# EAGLE design pot-boardDesp (EAGLE 6.6.0)
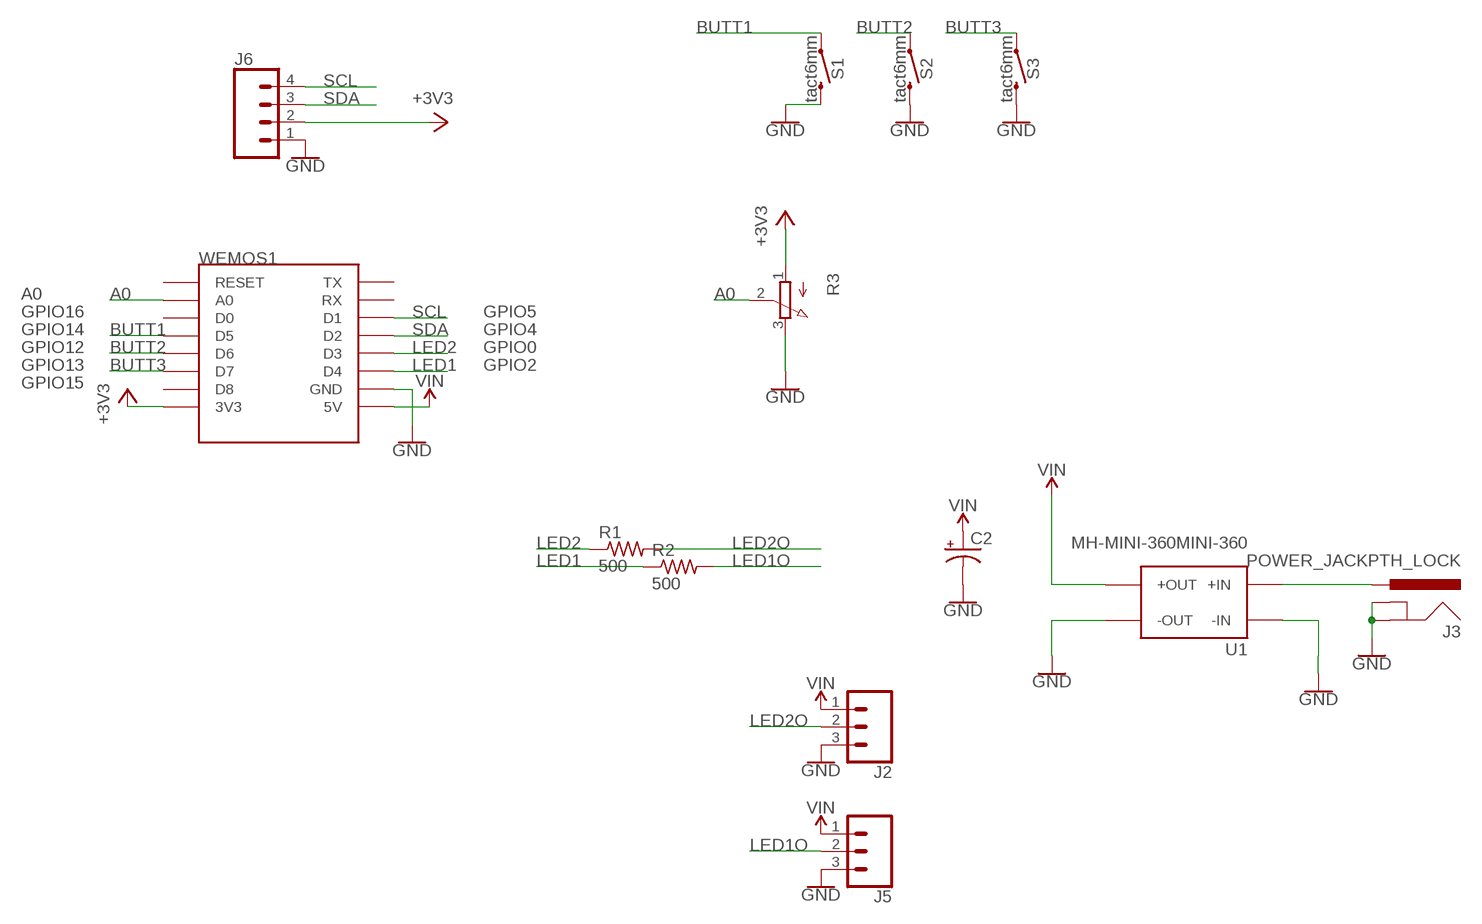
[diagram p0: schematic, sheet 1]

## Parts
C2  CPOL-USE3.5-8  [E3,5-8]
J2  CONN_03  [1X03]
J3  POWER_JACKPTH_LOCK  [POWER_JACK_PTH_LOCK]
J5  CONN_03  [1X03]
J6  CONN_04  [1X04]
R1  500  R-US_R0805  [R0805]
R2  500  R-US_R0805  [R0805]
R3  3RP/1610N  [3RP/1610N]
S1  tact6mm  MOMENTARY-SWITCH-SPST-PTH-6.0MM  [TACTILE_SWITCH_PTH_6.0MM]
S2  tact6mm  MOMENTARY-SWITCH-SPST-PTH-6.0MM  [TACTILE_SWITCH_PTH_6.0MM]
S3  tact6mm  MOMENTARY-SWITCH-SPST-PTH-6.0MM  [TACTILE_SWITCH_PTH_6.0MM]
U1  MH-MINI-360MINI-360  [MH-MINI-360]
WEMOS1  WEMOS-D1-MINI  [WEMOS-D1-MINI]

## Nets
+3V3: J6.2 R3.1(A) WEMOS1.3V3
A0: R3.2(S) WEMOS1.A0
BUTT1: S1.1 WEMOS1.D5
BUTT2: S2.1 WEMOS1.D6
BUTT3: S3.1 WEMOS1.D7
GND: C2.- J2.3 J3.GND J3.GNDBREAK J5.3 J6.1 R3.3(E) S1.3 S2.3 S3.3 U1.P$1(-IN) U1.P$4(-OUT) WEMOS1.GND
LED1: R2.1 WEMOS1.D4
LED1O: J5.2 R2.2
LED2: R1.1 WEMOS1.D3
LED2O: J2.2 R1.2
N$1: J3.PWR U1.P$2(+IN)
SCL: J6.4 WEMOS1.D1
SDA: J6.3 WEMOS1.D2
VIN: C2.+ J2.1 J5.1 U1.P$3(+OUT) WEMOS1.5V
Unconnected: WEMOS1.D0 WEMOS1.D8 WEMOS1.RESET WEMOS1.RX WEMOS1.TX

## Notes on the sheet
- A0
- GPIO16 | GPIO5
- GPIO14 | GPIO4
- GPIO12 | GPIO0
- GPIO13 | GPIO2
- GPIO15

## Library data of the parts
C2 = adafruit:CPOL-US: POLARIZED CAPACITOR, American symbol
J2 J5 = SparkFun-Connectors:CONN_03: Multi connection point. Often used as Generic Header-pin footprint for 0.1 inch spaced/style header connections On any of the 0.1 inch spaced packages, you can populate with these: Break Away Headers - Straight <https://www.sparkfun.com/products/116> (PRT-00116) Break Away Male Headers - Right Angle <https://www.sparkfun.com/products/553> (PRT-00553) Female Headers <https://www.sparkfun.com/products/115> (PRT-00115) Break Away Headers - Machine Pin <https://www.sparkfun.com/products/117> (PRT-00117) Break Away Female Headers - Swiss Machine Pin <https://www.sparkfun.com/products/743> (PRT-00743) Stackable Header - 3 Pin (Female, 0.1") <https://www.sparkfun.com/products/13875> (PRT-13875) For SCREWTERMINALS and SPRING TERMINALS visit here: Screw Terimnals on SparkFun.com <https://www.sparkfun.com/search/results?term=Screw+Terminals> (5mm/3.5mm/2.54mm spacing) This device is also useful as a general connection point to wire up your design to another part of your project. Our various solder wires solder well into these plated through hole pads. Hook-Up Wire - Assortment (Stranded, 22 AWG) <https://www.sparkfun.com/products/11375> (PRT-11375) Hook-Up Wire - Assortment (Solid Core, 22 AWG) <https://www.sparkfun.com/products/11367> (PRT-11367) View the entire wire category on our website here <https://www.sparkfun.com/categories/141> Special notes: Molex polarized connector foot print use with SKU : PRT-08232 with associated crimp pins and housings.
J3 = SparkFun-Connectors:POWER_JACK: Power Jack Connector This is the standard 5.5mm barrel jack for power. The PTH is the most common, proven, reliable, footprint. The Slot footprint only works if the mill layer is transmitted to the PCB fab house so be warned. Here are the connectors we sell at SparkFun: DC Barrel Power Jack/Connector <https://www.sparkfun.com/products/119> (PRT-00119) DC Barrel Power Jack/Connector (SMD) <https://www.sparkfun.com/products/12748> (PRT-12748) DC Barrel Jack Adapter - Breadboard Compatible <https://www.sparkfun.com/products/10811> (PRT-10811) It is used on this SparkFun product (and many, many others): SparkFun RedBoard - Programmed with Arduino <https://www.sparkfun.com/products/12757> (DEV-12757) Also, if you need a mating power supply or connector, please check these out: Wall Adapter Power Supply - 9VDC 650mA <https://www.sparkfun.com/products/298> (TOL-00298) DC Barrel Jack Adapter - Male <https://www.sparkfun.com/products/10287> (PRT-10287); PROD_ID: CONN-08197; SF_ID: PRT-00119
J6 = SparkFun-Connectors:CONN_04: Multi connection point. Often used as Generic Header-pin footprint for 0.1 inch spaced/style header connections On any of the 0.1 inch spaced packages, you can populate with these: Break Away Headers - Straight <https://www.sparkfun.com/products/116> (PRT-00116) Break Away Male Headers - Right Angle <https://www.sparkfun.com/products/553> (PRT-00553) Female Headers <https://www.sparkfun.com/products/115> (PRT-00115) Break Away Headers - Machine Pin <https://www.sparkfun.com/products/117> (PRT-00117) Break Away Female Headers - Swiss Machine Pin <https://www.sparkfun.com/products/743> (PRT-00743) For SCREWTERMINALS and SPRING TERMINALS visit here: Screw Terimnals on SparkFun.com <https://www.sparkfun.com/search/results?term=Screw+Terminals> (5mm/3.5mm/2.54mm spacing) This device is also useful as a general connection point to wire up your design to another part of your project. Our various solder wires solder well into these plated through hole pads. Hook-Up Wire - Assortment (Stranded, 22 AWG) <https://www.sparkfun.com/products/11375> (PRT-11375) Hook-Up Wire - Assortment (Solid Core, 22 AWG) <https://www.sparkfun.com/products/11367> (PRT-11367) View the entire wire category on our website here <https://www.sparkfun.com/categories/141> Special notes: Molex polarized connector foot print use with SKU : PRT-08231 with associated crimp pins and housings. 1MM SMD Version SKU: PRT-10208; PROD_ID: CONN-09696
R1 R2 = adafruit:R-US_: RESISTOR, American symbol
R3 = pot:3RP/1610N: 16mm Potentiometer one level Source: http://www.alphapotentiometers.net/html/16mm_pot_2.html
S1-S3 = SparkFun-Switches:MOMENTARY-SWITCH-SPST: Momentary Switch (Pushbutton) - SPST Normally-open (NO) SPST momentary switches (buttons, pushbuttons). Variants PTH-12MM - 12mm square, through-hole Momentary Pushbutton Switch - 12mm Square <https://www.sparkfun.com/products/9190> (COM-09190) PTH-6.0MM, PTH-6.0MM-KIT - 6.0mm square, through-hole Mini Pushbutton Switch <https://www.sparkfun.com/products/97> (COM-00097) KIT package intended for soldering kit's - only one side of pads' copper is exposed. PTH-RIGHT-ANGLE-KIT - Right-angle, through-hole Right Angle Tactile Button <https://www.sparkfun.com/products/10791> - Used on SparkFun BigTime Watch Kit <https://www.sparkfun.com/products/11734> SMD-12MM - 12mm square, surface-mount Tactile Button - SMD (12mm) <https://www.sparkfun.com/products/12993> (COM-12993) Used on SparkFun PicoBoard <https://www.sparkfun.com/products/11888> SMD-4.5MM - 4.5mm Square Trackball Switch Used on SparkFun Blackberry Trackballer Breakout <https://www.sparkfun.com/products/13169> SMD-4.6MMX2.8MM - 4.60mm x 2.80mm, surface mount Used on SparkFun SAMD21 Mini Breakout <https://www.sparkfun.com/products/13664> SMD-5.2MM, SMD-5.2-REDUNDANT - 5.2mm square, surface-mount Mini Pushbutton Switch - SMD <https://www.sparkfun.com/products/8720> (COM-08720) Used on Arduino Pro Mini <https://www.sparkfun.com/products/11114> REDUNDANT package connects both switch circuits together SMD-6.0X3.5MM - 6.0 x 3.5mm, surface mount Momentary Reset Switch SMD <https://www.sparkfun.com/products/8229> (COM-08229) SMD-6.2MM-TALL - 6.2mm square, surface mount Tactile Button - SMD (6mm) <https://www.sparkfun.com/products/12992> Used on SparkFun Digital Sandbox <https://www.sparkfun.com/products/12651> SMD-RIGHT-ANGLE - Right-angle, surface mount Used on SparkFun Block for Intel® Edison - Arduino <https://www.sparkfun.com/products/13036>; PROD_ID: SWCH-08441; SF_SKU: COM-00097
U1 = MP1584EN-1484249208697-powermodules:MH-MINI-360
WEMOS1 = esp8266modules:WEMOS-D1-MINI: WeMos.cc D1 mini ESP8266 module

## Board
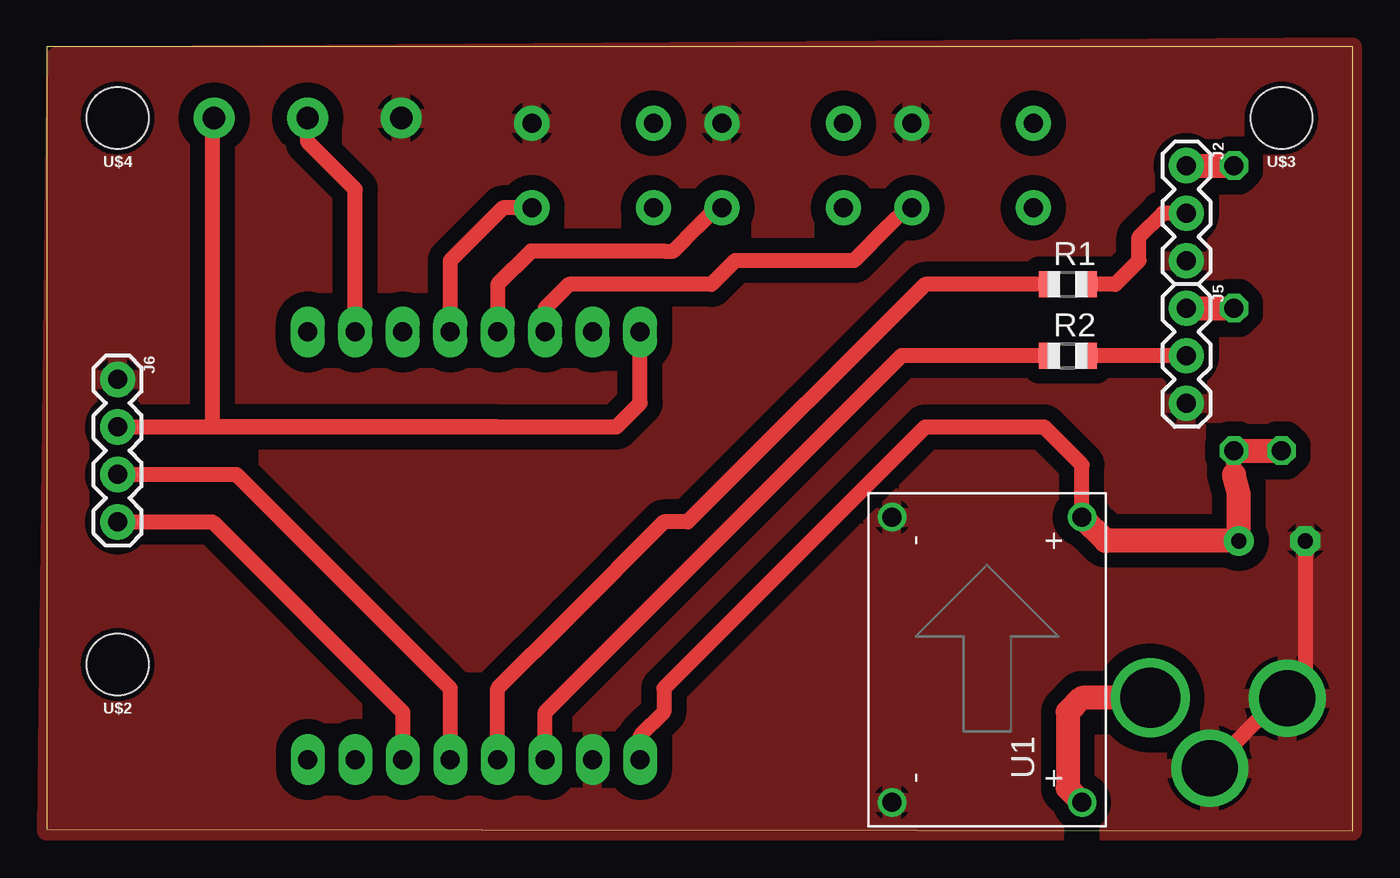
[diagram p1: board, top side]
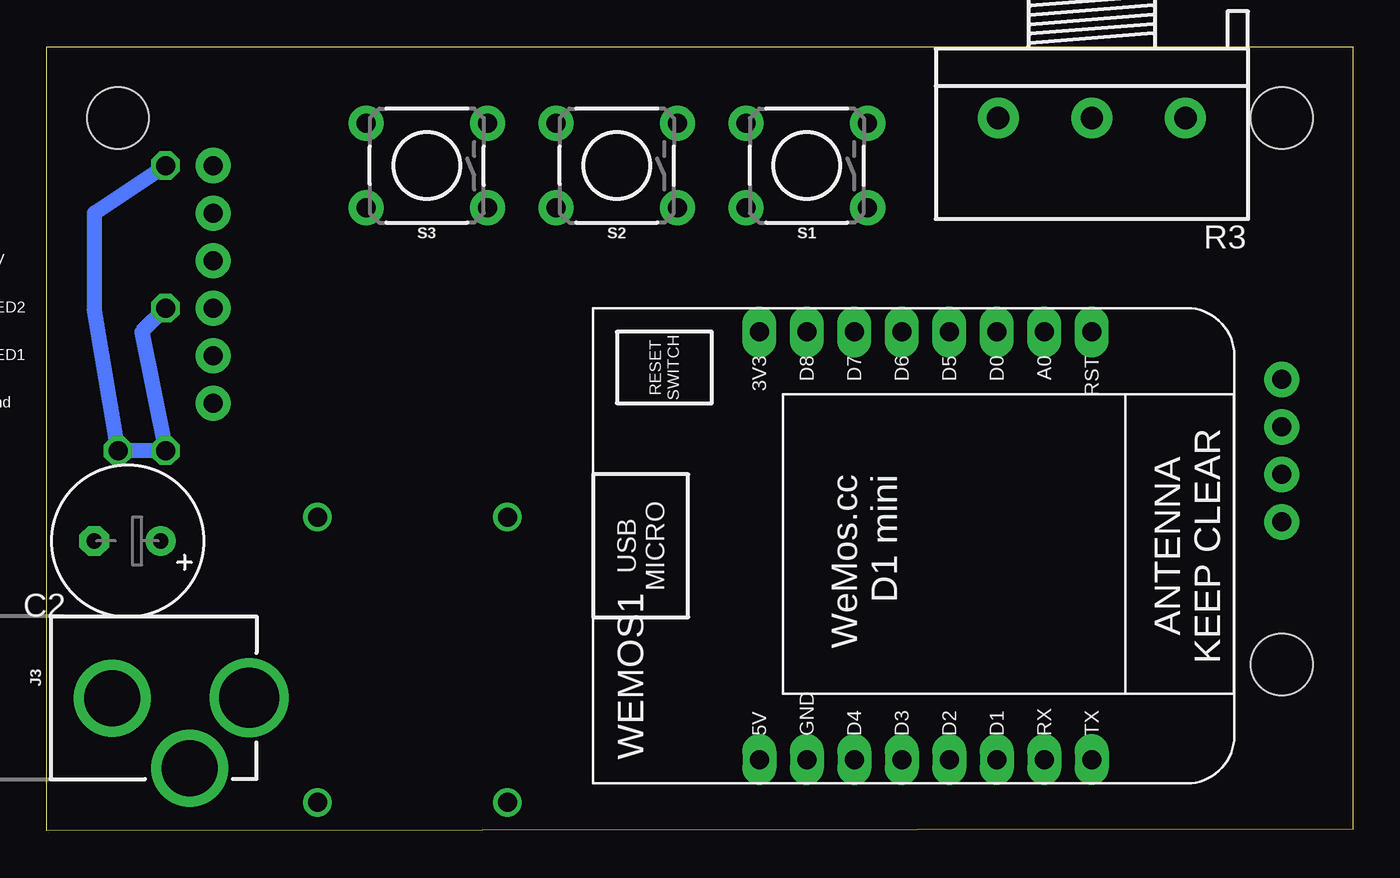
[diagram p2: board, bottom side, seen from below]

Size 69.83 x 41.91 mm. Coordinates in mm from the lower left corner, seen from the top.
Outline: 69.83,41.91 0,41.91 0,0.08 69.83,0 69.83,41.91
Copper layers (1*16): Top 0.035mm / dielectric 1.5mm / Bottom 0.035mm
Design rules "OthermillDRC_1_32_v2": minimum track width 8mil, minimum drill 0.8mm, track to track 0.794003125mm, track to pad 0.794003125mm, pad to pad 0.794003125mm, via to via 0.794003125mm, smd to smd 0mil, copper to edge 0mil, drill to drill 1mil, minimum pad ring 10mil, minimum via ring 10mil, stop-mask expansion 1mil, vias tented up to drill 30mil, thermal gap 10mil

### Footprints (pad centres in the part's own frame; a part is rotated, then mirrored left to right if it is on the bottom)
E3,5-8 = drill 0.813 pad 1.6: + -1.778,0 | drill 0.813 pad 1.6 octagon: - 1.778,0
1X03 = drill 1.016 pad 1.88: 1 0,0; 2 2.54,0; 3 5.08,0
POWER_JACK_PTH_LOCK = drill 2.997 pad 4.115: GND 0.025,6.557; GNDBREAK 3.762,10.7 | drill 3.2 pad 4.115: PWR 0,13.878
1X04 = drill 1.016 pad 1.88: 1 0,0; 2 2.54,0; 3 5.08,0; 4 7.62,0
R0805 = smd 1.1 x 1.4: 1 -1,0; 2 1,0
3RP/1610N = drill 1.2 pad 2.184: 1 -5,0; 2 0,0; 3 5,0
TACTILE_SWITCH_PTH_6.0MM = drill 1.016 pad 1.88: 1 -3.251,2.261; 2 3.251,2.261; 3 -3.251,-2.261; 4 3.251,-2.261
MH-MINI-360 = drill 1.016: P$1 -7.62,5.08; P$2 -7.62,-5.08; P$3 7.62,-5.08; P$4 7.62,5.08
STAND-OFF = hole 3.302: 0,0
WEMOS-D1-MINI = drill 1.016 pad 1.829 long: 3V3 -10.16,-10.16; 5V 12.7,-10.16; A0 -10.16,5.08; D0 -10.16,2.54; D1 12.7,2.54; D2 12.7,0; D3 12.7,-2.54; D4 12.7,-5.08; D5 -10.16,0; D6 -10.16,-2.54; D7 -10.16,-5.08; D8 -10.16,-7.62; GND 12.7,-7.62; RESET -10.16,7.62; RX 12.7,5.08; TX 12.7,7.62

### Placement (x,y rotation side)
C2  65.51,15.49 180 bottom
J2  60.94,35.56 270 top
J3  72.88,7.11 270 bottom
J5  60.94,27.94 270 top
J6  3.79,24.13 270 top
R1  54.59,29.21 0 top
R2  54.59,25.4 0 top
R3  13.95,38.1 180 bottom
S1  29.19,35.56 180 bottom
S2  39.35,35.56 180 bottom
S3  49.51,35.56 180 bottom
U1  50.27,9.14 90 top
U$2  [STAND-OFF]  3.79,8.89 180 top
U$3  [STAND-OFF]  66.02,38.1 180 top
U$4  [STAND-OFF]  3.79,38.1 180 top
WEMOS1  21.57,16.51 270 bottom

### Tracks (layer width: path | path; a pad name or v marks a point on that pad's centre or on a via)
+3V3
  Top 0.813: J6.2 8.87,21.59 | 8.87,21.59 24.11,21.59 | 24.11,21.59 30.46,21.59 31.73,22.86 WEMOS1.3V3 | 24.11,21.59 8.87,21.59 | 8.87,21.59 8.87,25.4 8.87,36.91 R3.1
A0
  Top 0.813: WEMOS1.A0 16.49,34.29 13.95,36.83 R3.2
BUTT1
  Top 0.813: S1.1 24.39,33.3 21.57,30.48 WEMOS1.D5
BUTT2
  Top 0.813: WEMOS1.D6 24.11,29.21 25.89,30.99 33,30.99 33.51,30.99 34.83,32.31 35.82,33.3 S2.1
BUTT3
  Top 0.813: WEMOS1.D7 26.65,27.94 27.92,29.21 35.54,29.21 36.81,30.48 43.16,30.48 44.99,32.31 45.98,33.3 S3.1
GND
  Top 0.813: J3.GNDBREAK 65.91,7.09 J3.GND 67.29,8.06 C2.-
  pour Top: -0.02,0 69.83,0 69.83,41.91 0.49,41.4
LED1
  Top 0.813: R2.1 45.7,25.4 34.27,13.97 27.92,7.62 26.65,6.35 WEMOS1.D4
LED1O
  Top 0.813: J5.2 57.13,25.4 55.86,25.4 R2.2
LED2
  Top 0.813: R1.1 53.32,29.21 46.97,29.21 34.27,16.51 33,16.51 27.92,11.43 24.11,7.62 WEMOS1.D3
LED2O
  Top 0.813: J2.2 59.67,33.02 58.4,31.75 58.4,30.48 57.13,29.21 R1.2
N$1
  Top 1.27: J3.PWR 55.35,7.11 54.59,6.35 54.59,2.29 U1.P$2
SCL
  Top 0.813: J6.4 6.33,16.51 8.87,16.51 19.03,6.35 WEMOS1.D1
SDA
  Top 0.813: J6.3 10.14,19.05 21.57,7.62 21.57,5.08 WEMOS1.D2
VIN  (via drill 1.02)
  Top 0.813: WEMOS1.5V 31.73,5.08 33,6.35 33,7.62 46.97,21.59 53.32,21.59 55.35,19.56 U1.P$3 | 63.48,19.05 v63.48,20.32
  Top 1.27: U1.P$3 56.62,15.49 C2.+ 63.73,18.03 63.48,19.05 | J2.1 v63.48,35.56 | J5.1 v63.48,27.94 | v63.48,20.32 v66.02,20.32
  Bottom 0.813: v63.48,35.56 67.29,33.02 67.29,27.94 v66.02,20.32 v63.48,20.32 64.75,26.67 v63.48,27.94

### Text on the board
tPlace: ILOVELAMP | pot-boardDesp
bPlace: 5V | LED2 | LED1 | gnd